# Altium schematic sheet high_level.SchDoc
size A3; SheetNumber: 1; SheetTotal: 13
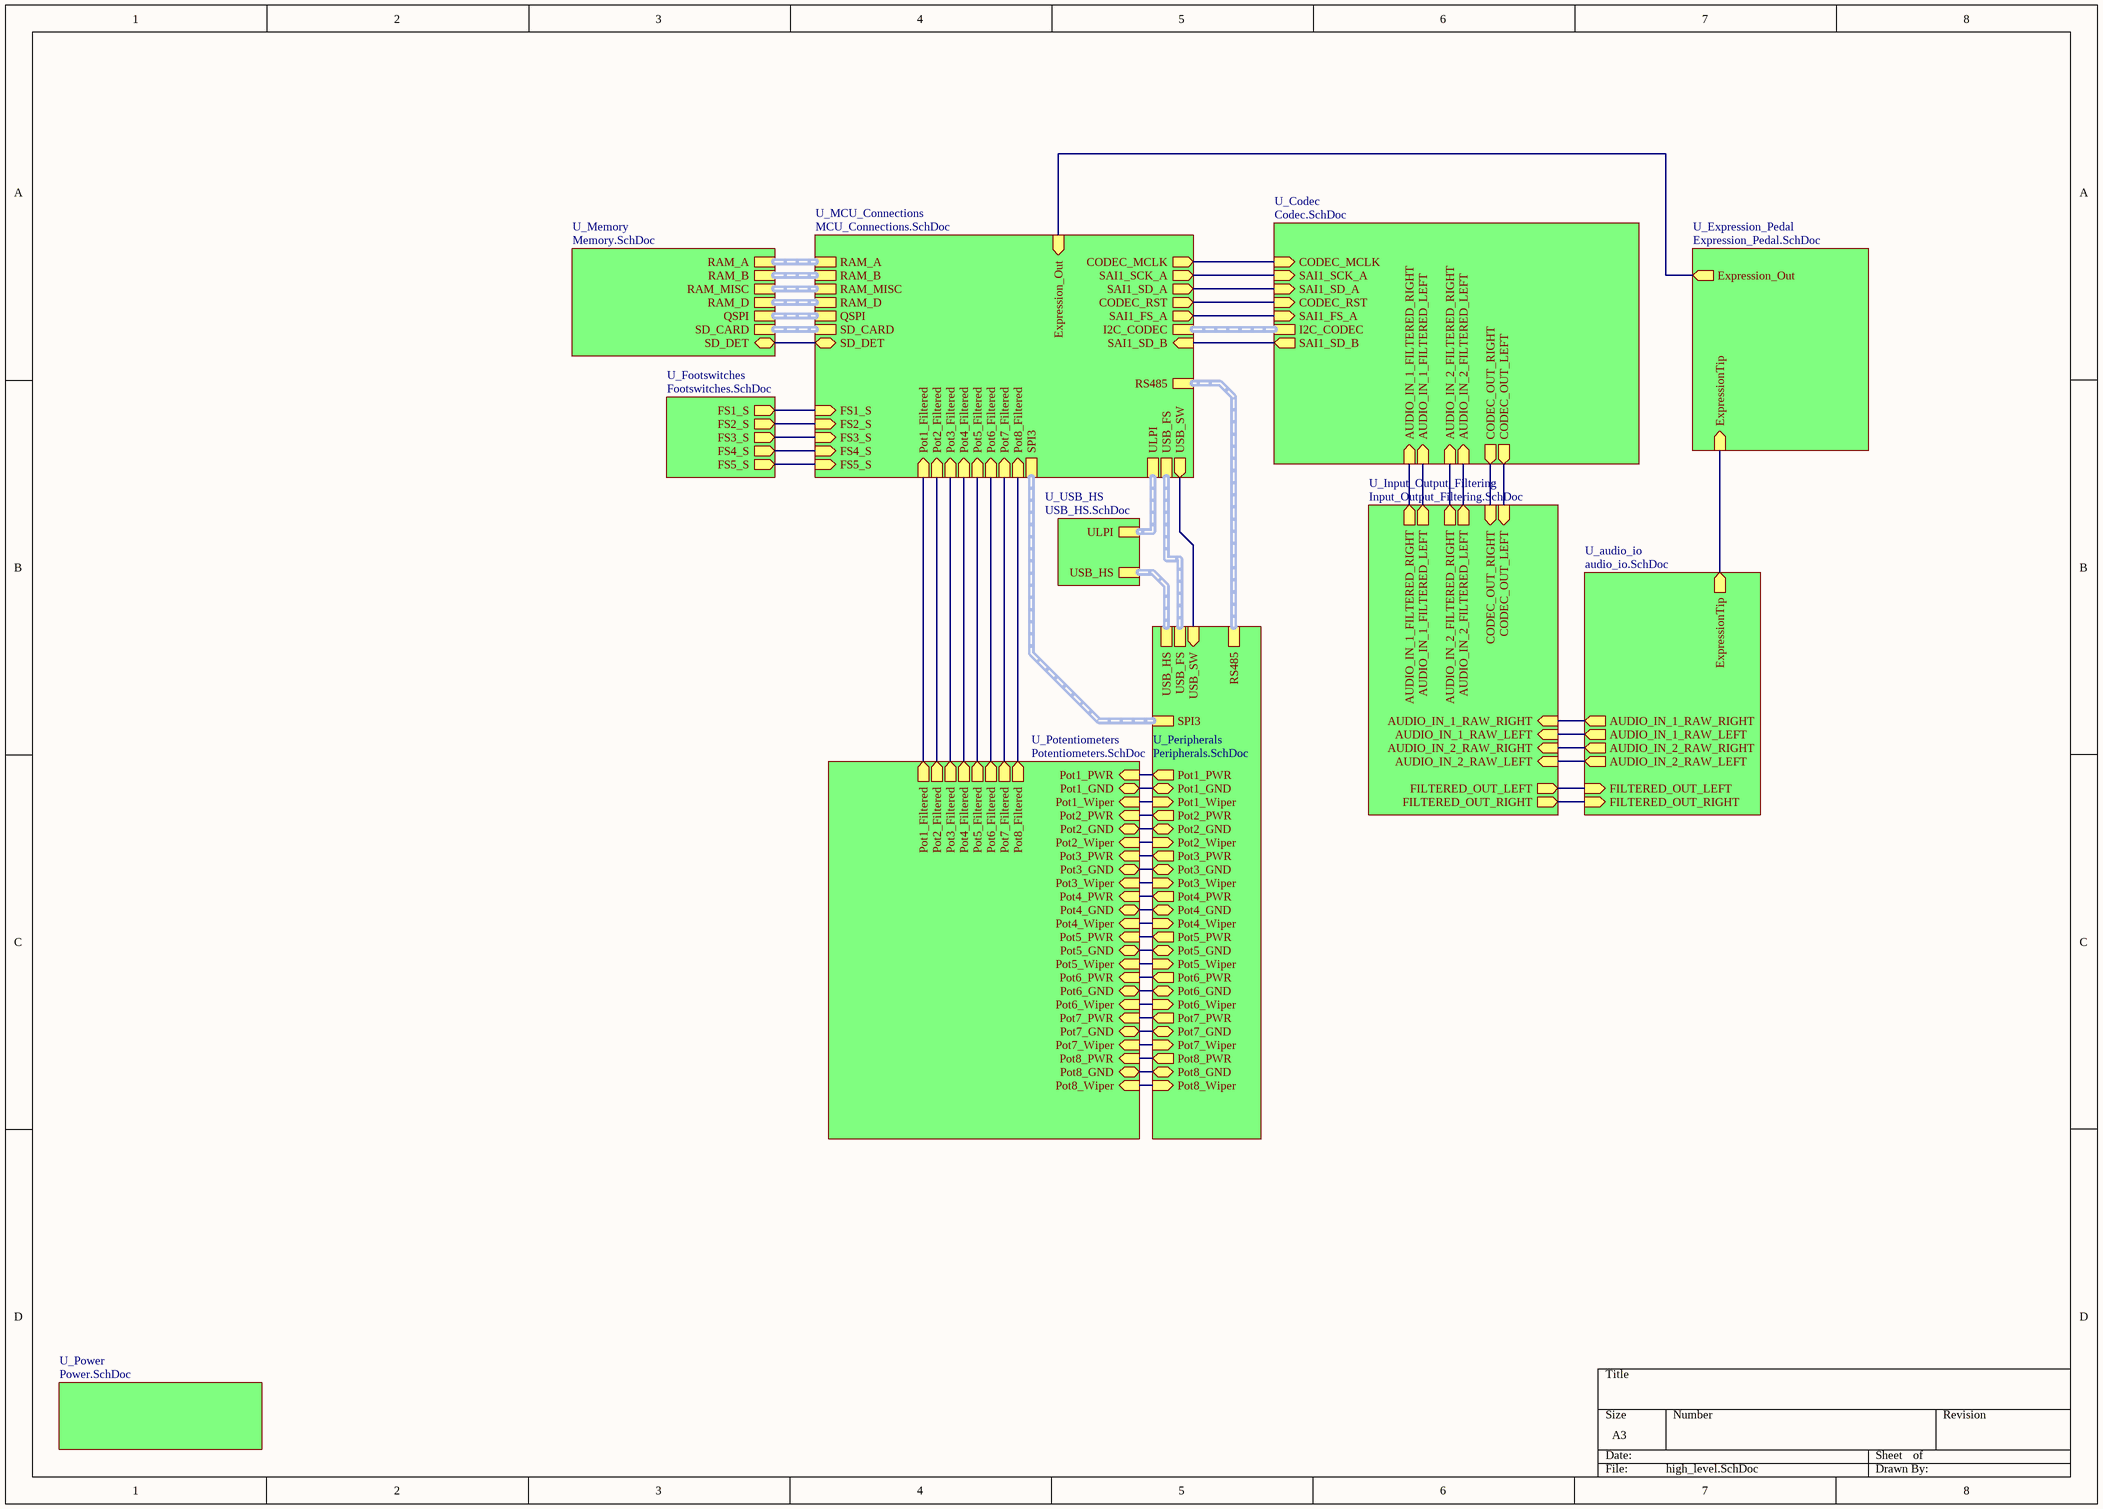
[diagram p0: high_level.SchDoc]

## Sub-sheets
U_audio_io = audio_io.SchDoc: ExpressionTip (out), AUDIO_IN_1_RAW_RIGHT (out), AUDIO_IN_1_RAW_LEFT (out), AUDIO_IN_2_RAW_LEFT (out), FILTERED_OUT_LEFT (in), FILTERED_OUT_RIGHT (in), AUDIO_IN_2_RAW_RIGHT (out)
U_Codec = Codec.SchDoc: CODEC_MCLK (in), SAI1_SCK_A (in), SAI1_SD_B (out), SAI1_SD_A (in), CODEC_RST (in), AUDIO_IN_2_FILTERED_LEFT (in), AUDIO_IN_2_FILTERED_RIGHT (in), CODEC_OUT_RIGHT (out), CODEC_OUT_LEFT (out), AUDIO_IN_1_FILTERED_LEFT (in), AUDIO_IN_1_FILTERED_RIGHT (in), I2C_CODEC (harness I2C), SAI1_FS_A (in)
U_Expression_Pedal = Expression_Pedal.SchDoc: ExpressionTip (in), Expression_Out (out)
U_Footswitches = Footswitches.SchDoc: FS1_S (out), FS2_S (out), FS3_S (out), FS4_S (out), FS5_S (out)
U_Input_Output_Filtering = Input_Output_Filtering.SchDoc: AUDIO_IN_1_RAW_LEFT (in), AUDIO_IN_1_FILTERED_LEFT (out), AUDIO_IN_1_RAW_RIGHT (in), AUDIO_IN_1_FILTERED_RIGHT (out), CODEC_OUT_LEFT (in), FILTERED_OUT_LEFT (out), CODEC_OUT_RIGHT (in), FILTERED_OUT_RIGHT (out), AUDIO_IN_2_RAW_LEFT (in), AUDIO_IN_2_FILTERED_LEFT (out), AUDIO_IN_2_RAW_RIGHT (in), AUDIO_IN_2_FILTERED_RIGHT (out)
U_MCU_Connections = MCU_Connections.SchDoc: ULPI (harness ULPI), RAM_A (harness RAM_A), RAM_B (harness RAM_B), RAM_MISC (harness RAM_MISC), RAM_D (harness RAM_D), QSPI (harness QSPI), SD_CARD (harness SD_CARD), USB_FS (harness USB_FS), USB_SW (out), I2C_CODEC (harness I2C), CODEC_MCLK (out), SAI1_SCK_A (out), SAI1_SD_B (in), SAI1_SD_A (out), CODEC_RST (out), Expression_Out (in), SAI1_FS_A (out), SD_DET (bidir), SPI3 (harness SPI3), Pot1_Filtered (in), Pot2_Filtered (in), Pot3_Filtered (in), Pot4_Filtered (in), Pot5_Filtered (in), Pot6_Filtered (in), Pot7_Filtered (in), Pot8_Filtered (in), RS485 (harness RS485), FS1_S (in), FS2_S (in), FS3_S (in), FS4_S (in), FS5_S (in)
U_Memory = Memory.SchDoc: RAM_D (harness RAM_D), RAM_A (harness RAM_A), RAM_B (harness RAM_B), RAM_MISC (harness RAM_MISC), SD_CARD (harness SD_CARD), SD_DET (bidir), QSPI (harness QSPI)
U_Peripherals = Peripherals.SchDoc: USB_SW (in), USB_HS (harness USB_HS), USB_FS (harness USB_FS), SPI3 (harness SPI3), Pot5_PWR (out), Pot5_Wiper (in), Pot5_GND (bidir), Pot4_PWR (out), Pot4_Wiper (in), Pot4_GND (bidir), Pot8_PWR (out), Pot8_Wiper (in), Pot8_GND (bidir), Pot6_PWR (out), Pot6_Wiper (in), Pot6_GND (bidir), Pot2_PWR (out), Pot2_Wiper (in), Pot2_GND (bidir), Pot1_Wiper (in), Pot1_GND (bidir), Pot7_PWR (out), Pot7_Wiper (in), Pot7_GND (bidir), Pot3_PWR (out), Pot3_Wiper (in), Pot3_GND (bidir), Pot1_PWR (out), RS485 (harness RS485)
U_Potentiometers = Potentiometers.SchDoc: Pot1_PWR (in), Pot1_Wiper (in), Pot1_GND (bidir), Pot2_PWR (in), Pot2_Wiper (in), Pot2_GND (bidir), Pot3_PWR (in), Pot3_Wiper (in), Pot3_GND (bidir), Pot4_PWR (in), Pot4_Wiper (in), Pot4_GND (bidir), Pot5_PWR (in), Pot5_Wiper (in), Pot5_GND (bidir), Pot6_PWR (in), Pot6_Wiper (in), Pot6_GND (bidir), Pot7_PWR (in), Pot7_Wiper (in), Pot7_GND (bidir), Pot8_PWR (in), Pot8_Wiper (in), Pot8_GND (bidir), Pot1_Filtered (out), Pot2_Filtered (out), Pot3_Filtered (out), Pot7_Filtered (out), Pot4_Filtered (out), Pot5_Filtered (out), Pot6_Filtered (out), Pot8_Filtered (out)
U_Power = Power.SchDoc: no entries
U_USB_HS = USB_HS.SchDoc: USB_HS (harness USB), ULPI (harness ULPI)

## Nets
(unnamed): sheet U_Codec/CODEC_MCLK, sheet U_MCU_Connections/CODEC_MCLK
(unnamed): sheet U_Codec/SAI1_SCK_A, sheet U_MCU_Connections/SAI1_SCK_A
(unnamed): sheet U_Codec/SAI1_SD_B, sheet U_MCU_Connections/SAI1_SD_B
(unnamed): sheet U_Codec/SAI1_SD_A, sheet U_MCU_Connections/SAI1_SD_A
(unnamed): sheet U_Codec/CODEC_RST, sheet U_MCU_Connections/CODEC_RST
(unnamed): sheet U_Codec/AUDIO_IN_2_FILTERED_LEFT, sheet U_Input_Output_Filtering/AUDIO_IN_2_FILTERED_LEFT
(unnamed): sheet U_Codec/AUDIO_IN_2_FILTERED_RIGHT, sheet U_Input_Output_Filtering/AUDIO_IN_2_FILTERED_RIGHT
(unnamed): sheet U_Codec/CODEC_OUT_RIGHT, sheet U_Input_Output_Filtering/CODEC_OUT_RIGHT
(unnamed): sheet U_Codec/CODEC_OUT_LEFT, sheet U_Input_Output_Filtering/CODEC_OUT_LEFT
(unnamed): sheet U_Codec/AUDIO_IN_1_FILTERED_LEFT, sheet U_Input_Output_Filtering/AUDIO_IN_1_FILTERED_LEFT
(unnamed): sheet U_Codec/AUDIO_IN_1_FILTERED_RIGHT, sheet U_Input_Output_Filtering/AUDIO_IN_1_FILTERED_RIGHT
(unnamed): sheet U_Codec/SAI1_FS_A, sheet U_MCU_Connections/SAI1_FS_A
(unnamed): sheet U_Expression_Pedal/ExpressionTip, sheet U_audio_io/ExpressionTip
(unnamed): sheet U_Expression_Pedal/Expression_Out, sheet U_MCU_Connections/Expression_Out
(unnamed): sheet U_Input_Output_Filtering/AUDIO_IN_1_RAW_LEFT, sheet U_audio_io/AUDIO_IN_1_RAW_LEFT
(unnamed): sheet U_Input_Output_Filtering/AUDIO_IN_1_RAW_RIGHT, sheet U_audio_io/AUDIO_IN_1_RAW_RIGHT
(unnamed): sheet U_Input_Output_Filtering/FILTERED_OUT_LEFT, sheet U_audio_io/FILTERED_OUT_LEFT
(unnamed): sheet U_Input_Output_Filtering/FILTERED_OUT_RIGHT, sheet U_audio_io/FILTERED_OUT_RIGHT
(unnamed): sheet U_Input_Output_Filtering/AUDIO_IN_2_RAW_LEFT, sheet U_audio_io/AUDIO_IN_2_RAW_LEFT
(unnamed): sheet U_Input_Output_Filtering/AUDIO_IN_2_RAW_RIGHT, sheet U_audio_io/AUDIO_IN_2_RAW_RIGHT
(unnamed): sheet U_Memory/SD_DET, sheet U_MCU_Connections/SD_DET
(unnamed): sheet U_Peripherals/USB_SW, sheet U_MCU_Connections/USB_SW
(unnamed): sheet U_Peripherals/Pot5_PWR, sheet U_Potentiometers/Pot5_PWR
(unnamed): sheet U_Peripherals/Pot5_Wiper, sheet U_Potentiometers/Pot5_Wiper
(unnamed): sheet U_Peripherals/Pot5_GND, sheet U_Potentiometers/Pot5_GND
(unnamed): sheet U_Peripherals/Pot4_PWR, sheet U_Potentiometers/Pot4_PWR
(unnamed): sheet U_Peripherals/Pot4_Wiper, sheet U_Potentiometers/Pot4_Wiper
(unnamed): sheet U_Peripherals/Pot4_GND, sheet U_Potentiometers/Pot4_GND
(unnamed): sheet U_Peripherals/Pot8_PWR, sheet U_Potentiometers/Pot8_PWR
(unnamed): sheet U_Peripherals/Pot8_Wiper, sheet U_Potentiometers/Pot8_Wiper
(unnamed): sheet U_Peripherals/Pot8_GND, sheet U_Potentiometers/Pot8_GND
(unnamed): sheet U_Peripherals/Pot6_PWR, sheet U_Potentiometers/Pot6_PWR
(unnamed): sheet U_Peripherals/Pot6_Wiper, sheet U_Potentiometers/Pot6_Wiper
(unnamed): sheet U_Peripherals/Pot6_GND, sheet U_Potentiometers/Pot6_GND
(unnamed): sheet U_Peripherals/Pot2_PWR, sheet U_Potentiometers/Pot2_PWR
(unnamed): sheet U_Peripherals/Pot2_Wiper, sheet U_Potentiometers/Pot2_Wiper
(unnamed): sheet U_Peripherals/Pot2_GND, sheet U_Potentiometers/Pot2_GND
(unnamed): sheet U_Peripherals/Pot1_Wiper, sheet U_Potentiometers/Pot1_Wiper
(unnamed): sheet U_Peripherals/Pot1_GND, sheet U_Potentiometers/Pot1_GND
(unnamed): sheet U_Peripherals/Pot7_PWR, sheet U_Potentiometers/Pot7_PWR
(unnamed): sheet U_Peripherals/Pot7_Wiper, sheet U_Potentiometers/Pot7_Wiper
(unnamed): sheet U_Peripherals/Pot7_GND, sheet U_Potentiometers/Pot7_GND
(unnamed): sheet U_Peripherals/Pot3_PWR, sheet U_Potentiometers/Pot3_PWR
(unnamed): sheet U_Peripherals/Pot3_Wiper, sheet U_Potentiometers/Pot3_Wiper
(unnamed): sheet U_Peripherals/Pot3_GND, sheet U_Potentiometers/Pot3_GND
(unnamed): sheet U_Peripherals/Pot1_PWR, sheet U_Potentiometers/Pot1_PWR
(unnamed): sheet U_Potentiometers/Pot1_Filtered, sheet U_MCU_Connections/Pot1_Filtered
(unnamed): sheet U_Potentiometers/Pot2_Filtered, sheet U_MCU_Connections/Pot2_Filtered
(unnamed): sheet U_Potentiometers/Pot3_Filtered, sheet U_MCU_Connections/Pot3_Filtered
(unnamed): sheet U_Potentiometers/Pot7_Filtered, sheet U_MCU_Connections/Pot7_Filtered
(unnamed): sheet U_Potentiometers/Pot4_Filtered, sheet U_MCU_Connections/Pot4_Filtered
(unnamed): sheet U_Potentiometers/Pot5_Filtered, sheet U_MCU_Connections/Pot5_Filtered
(unnamed): sheet U_Potentiometers/Pot6_Filtered, sheet U_MCU_Connections/Pot6_Filtered
(unnamed): sheet U_Potentiometers/Pot8_Filtered, sheet U_MCU_Connections/Pot8_Filtered
(unnamed): sheet U_MCU_Connections/FS1_S, sheet U_Footswitches/FS1_S
(unnamed): sheet U_MCU_Connections/FS2_S, sheet U_Footswitches/FS2_S
(unnamed): sheet U_MCU_Connections/FS3_S, sheet U_Footswitches/FS3_S
(unnamed): sheet U_MCU_Connections/FS4_S, sheet U_Footswitches/FS4_S
(unnamed): sheet U_MCU_Connections/FS5_S, sheet U_Footswitches/FS5_S

## Buses and harness runs
harness sheet U_Codec/I2C_CODEC = sheet U_MCU_Connections/I2C_CODEC
harness sheet U_MCU_Connections/QSPI = sheet U_Memory/QSPI
harness sheet U_MCU_Connections/RAM_A = sheet U_Memory/RAM_A
harness sheet U_MCU_Connections/RAM_B = sheet U_Memory/RAM_B
harness sheet U_MCU_Connections/RAM_D = sheet U_Memory/RAM_D
harness sheet U_MCU_Connections/RAM_MISC = sheet U_Memory/RAM_MISC
harness sheet U_MCU_Connections/RS485 = sheet U_Peripherals/RS485
harness sheet U_MCU_Connections/SD_CARD = sheet U_Memory/SD_CARD
harness sheet U_MCU_Connections/SPI3 = sheet U_Peripherals/SPI3
harness sheet U_MCU_Connections/ULPI = sheet U_USB_HS/ULPI
harness sheet U_MCU_Connections/USB_FS = sheet U_Peripherals/USB_FS
harness sheet U_Peripherals/USB_HS = sheet U_USB_HS/USB_HS